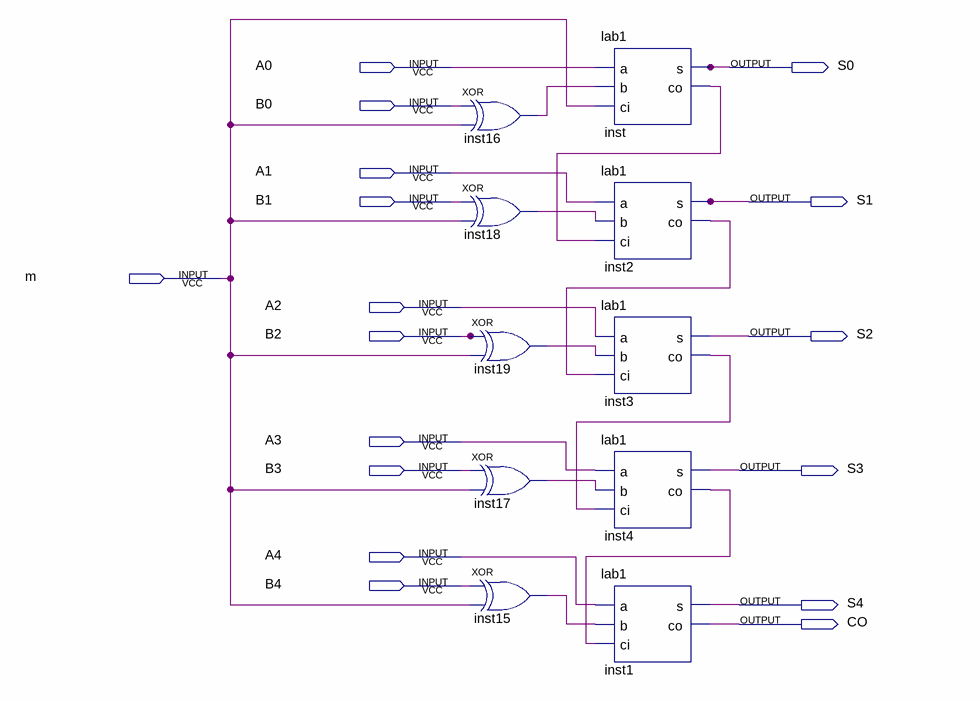
[diagram p0: schematic sheet]
// Quartus schematic calculateBCD.bdf as structural Verilog: 10 symbols, 17 pins
module calculateBCD (
  input  A0,
  input  B0,
  input  A1,
  input  B1,
  input  m,
  input  A2,
  input  B2,
  input  A3,
  input  B3,
  input  A4,
  input  B4,
  output S0,
  output S1,
  output S2,
  output S3,
  output S4,
  output CO
);

  wire inst2_co, inst3_co, inst4_co, inst15_out, inst16_out, inst17_out, inst18_out, inst19_out, inst_co;

  xor inst16 (inst16_out, B0, m);
  xor inst18 (inst18_out, B1, m);
  xor inst19 (inst19_out, B2, m);
  xor inst17 (inst17_out, B3, m);
  xor inst15 (inst15_out, B4, m);
  lab1 inst (.a(A0), .b(inst16_out), .ci(m), .s(S0), .co(inst_co));
  lab1 inst2 (.a(A1), .b(inst18_out), .ci(inst_co), .s(S1), .co(inst2_co));
  lab1 inst3 (.a(A2), .b(inst19_out), .ci(inst2_co), .s(S2), .co(inst3_co));
  lab1 inst4 (.a(A3), .b(inst17_out), .ci(inst3_co), .s(S3), .co(inst4_co));
  lab1 inst1 (.a(A4), .b(inst15_out), .ci(inst4_co), .s(S4), .co(CO));
endmodule
